# Altium schematic sheet 1_P1.schdoc
size 309 x 223 mm; Symbol: Sheet-Symbol_A4; Device: Sheet-Symbol_A4; Company: 嘉立创EDA; Version: V1.0; Page Size: A4; @Project Name: final; @Page Count: 1; @Update Date: 2024-05-03; @Create Date: 2024-05-03; @Schematic Name: Schematic1; @Page No: 1; @Page Name: P1
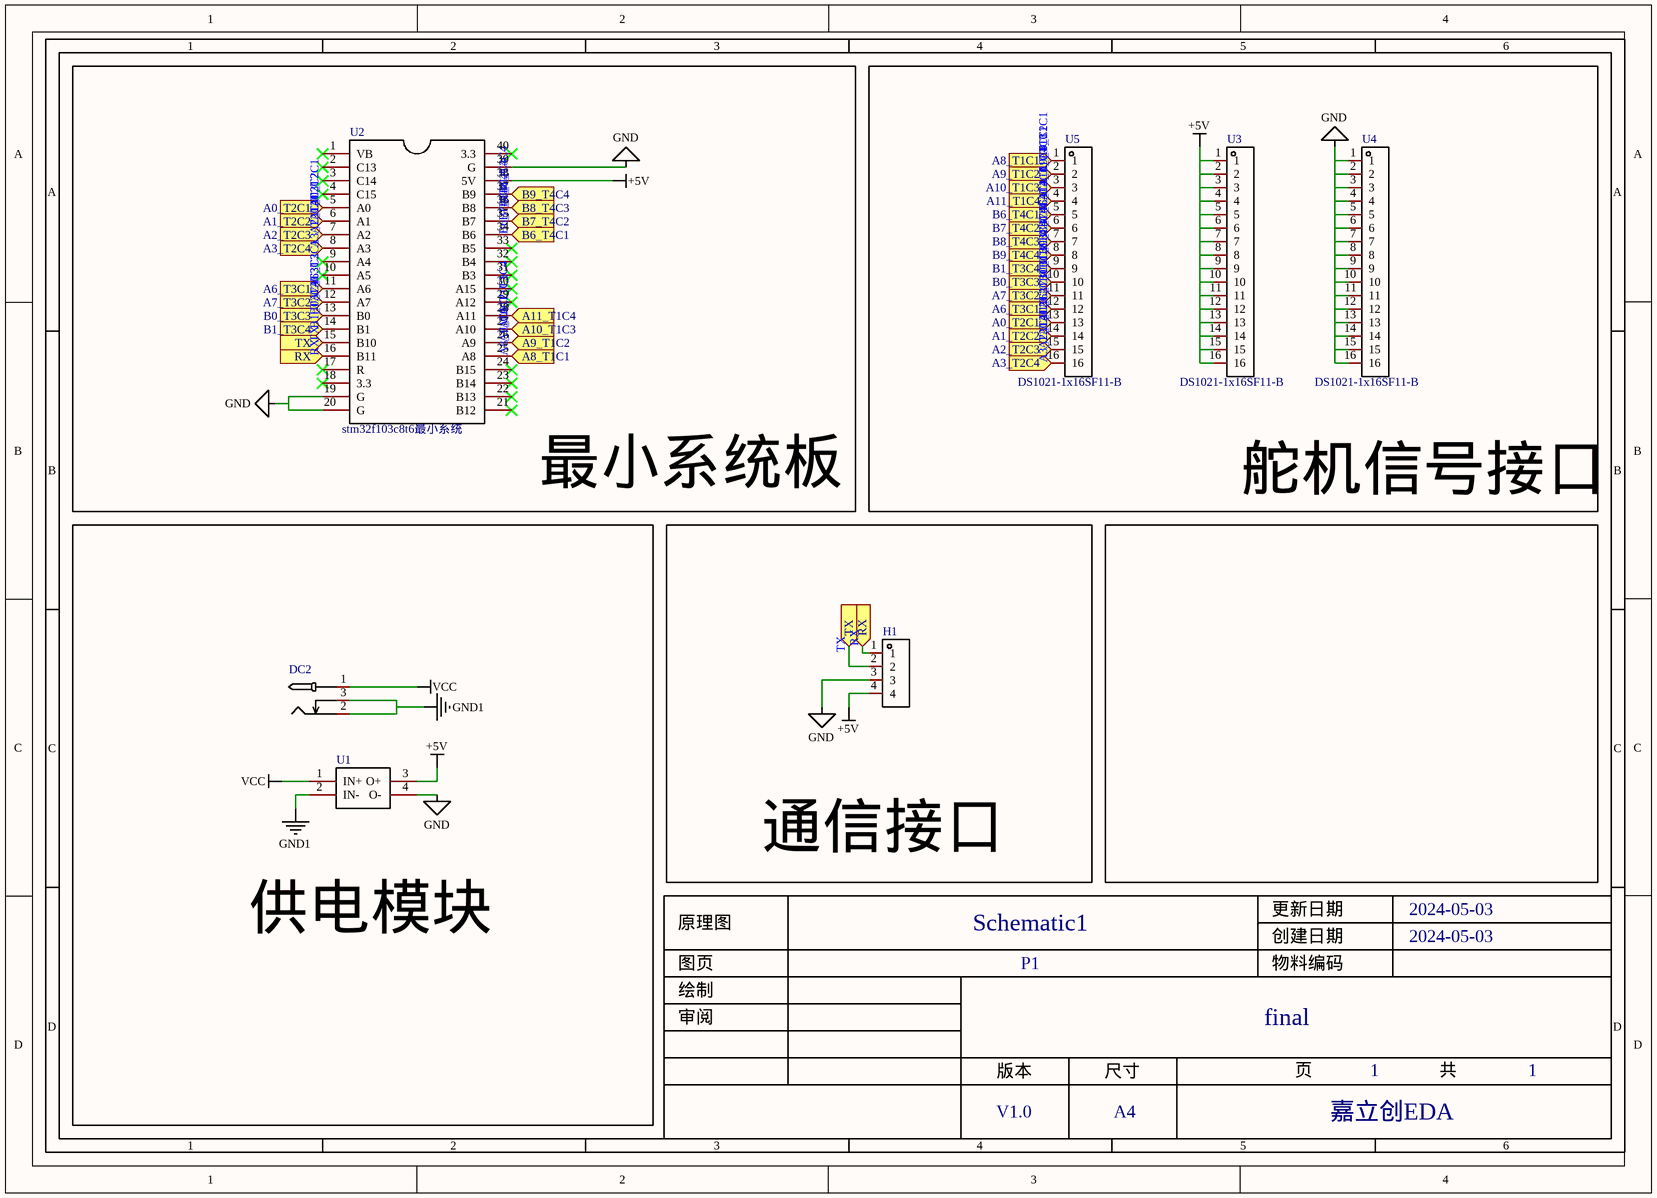
[diagram p0: 1_P1.schdoc]

## Parts
DC2  DC-005_2.5  [DC-005_2.5]  (value not drawn)
H1  HDR-F_2.54_1x4P  [HDR-TH_4P-P2.54-V-F]  (value not drawn)
U1  LM2596  [LM2596]  (value not drawn)
U2  stm32f103c8t6最小系统  [stm32f103c8t6最小系统]
U3  DS1021-1x16SF11-B  [HDR-TH_16P-P2.54-V-M]
U4  DS1021-1x16SF11-B  [HDR-TH_16P-P2.54-V-M]
U5  DS1021-1x16SF11-B  [HDR-TH_16P-P2.54-V-M]

## Blocks framed on the sheet
最小系统板: U2
舵机信号接口: U3-U5
供电模块: DC2 U1
通信接口: H1

## Ports
A0_T2C1 (in), A1_T2C2 (in), A2_T2C3 (in), A3_T2C4 (in), A6_T3C1 (in), A7_T3C2 (in), A8_T1C1 (in), A9_T1C2 (in), A10_T1C3 (in), A11_T1C4 (in), B0_T3C3 (in), B1_T3C4 (in), B6_T4C1 (in), B7_T4C2 (in), B8_T4C3 (in), B9_T4C4 (in), RX (in), TX (in)

## Nets
+5V: H1.4 U1.3(O+) U2.38(5V) U3.1 U3.2 U3.3 U3.4 U3.5 U3.6 U3.7 U3.8 U3.9 U3.10 U3.11 U3.12 U3.13 U3.14 U3.15 U3.16
GND: H1.3 U1.4(O-) U2.19(G) U2.20(G) U2.39(G) U4.1 U4.2 U4.3 U4.4 U4.5 U4.6 U4.7 U4.8 U4.9 U4.10 U4.11 U4.12 U4.13 U4.14 U4.15 U4.16
GND1: DC2.2 DC2.3 U1.2(IN-)
VCC: DC2.1 U1.1(IN+)
A0_T2C1: U2.5(A0) U5.13 ; port A0_T2C1
A1_T2C2: U2.6(A1) U5.14 ; port A1_T2C2
A2_T2C3: U2.7(A2) U5.15 ; port A2_T2C3
A3_T2C4: U2.8(A3) U5.16 ; port A3_T2C4
A6_T3C1: U2.11(A6) U5.12 ; port A6_T3C1
A7_T3C2: U2.12(A7) U5.11 ; port A7_T3C2
A8_T1C1: U2.25(A8) U5.1 ; port A8_T1C1
A9_T1C2: U2.26(A9) U5.2 ; port A9_T1C2
A10_T1C3: U2.27(A10) U5.3 ; port A10_T1C3
A11_T1C4: U2.28(A11) U5.4 ; port A11_T1C4
B0_T3C3: U2.13(B0) U5.10 ; port B0_T3C3
B1_T3C4: U2.14(B1) U5.9 ; port B1_T3C4
B6_T4C1: U2.34(B6) U5.5 ; port B6_T4C1
B7_T4C2: U2.35(B7) U5.6 ; port B7_T4C2
B8_T4C3: U2.36(B8) U5.7 ; port B8_T4C3
B9_T4C4: U2.37(B9) U5.8 ; port B9_T4C4
RX: H1.1 U2.16(B11) ; port RX
TX: H1.2 U2.15(B10) ; port TX

Not connected (* = marked no-connect by the designer): U2 1(VB)* 2(C13)* 3(C14)* 4(C15)* 9(A4)* 10(A5)* 17(R)* 18(3.3)* 21(B12)* 22(B13)* 23(B14)* 24(B15)* 29(A12)* 30(A15)* 31(B3)* 32(B4)* 33(B5)* 40(3.3)*

## Notes on the sheet
- 1
- 2
- 3
- 4
- 5
- 6
- A
- B
- C
- 原理图
- Schematic1
- 创建日期
- 更新日期
- 2024-05-03
- 审阅
- 绘制
- 图页
- P1
- 物料编码
- final
- D
- 版本
- 尺寸
- 页
- 共
- V1.0
- A4
- 嘉立创EDA

## Library data of the parts
DC2 = DC-005_2.5: Convert to PCB: yes; Symbol: DC-005_2.5; Device: DC-005_2.5; Add into BOM: yes; Supplier Footprint: 插件
H1 = HDR-F_2.54_1x4P: Manufacturer: BOOMELE(博穆精密); Symbol: 2.54-1*4P母; Convert to PCB: yes; Device: HDR-F_2.54_1x4P; Supplier: LCSC; Supplier Part: C2718488; Manufacturer Part: 2.54-1*4P母; JLCPCB Part Class: Extended Part; Add into BOM: yes; Supplier Footprint: 插件
U1 = LM2596: Add into BOM: yes; Symbol: LM2596; Device: LM2596; Convert to PCB: yes
U2 = stm32f103c8t6最小系统: Add into BOM: yes; Name: stm32f103c8t6最小系统; Symbol: stm32f103c8t6最小系统; Device: stm32f103c8t6最小系统; Convert to PCB: yes; attr-name: stm32f103c8t6最小系统
U3-U5 = DS1021-1x16SF11-B: 插针结构:1x16P;间距:2.54mm;安装类型:直插;排数:单排;总PIN位数:16P;; Manufacturer: CONNFLY; Add into BOM: yes; Pin Structure: 1x16P; Pitch: 2.54mm; Name: DS1021-1x16SF11-B; Symbol: DS1021-1X16SF11-B; Device: DS1021-1x16SF11-B; LCSC Part Name: 1x16P 间距:2.54mm 直插; Supplier Part: C7430372; Manufacturer Part: DS1021-1x16SF11-B; Supplier Footprint: 插件,P=2.54mm; Datasheet: https://atta.szlcsc.com/upload/public/pdf/source/20230721/045F128FE19DC325F71FA0C1C07679E3.pdf; Supplier: LCSC; Convert to PCB: yes; Mounting Type: 直插; Number of Rows: 单排; Number of Pins: 16P